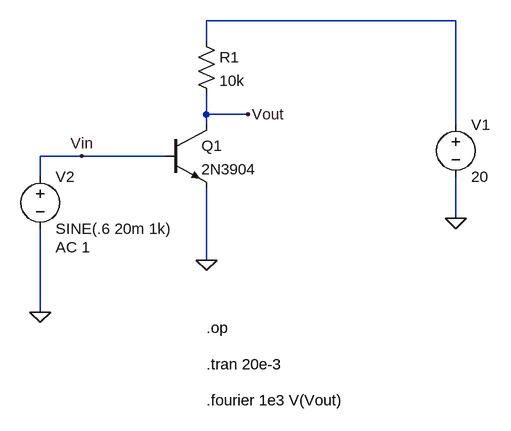
[diagram p0: schematic common_emitter_distortion.asc]
common_emitter_distortion.asc, the LTspice schematic file:
Version 4
SHEET 1 1576 680
WIRE 704 -48 320 -48
WIRE 320 -16 320 -48
WIRE 320 96 320 64
WIRE 384 96 320 96
WIRE 320 112 320 96
WIRE 704 112 704 -48
WIRE 128 160 64 160
WIRE 256 160 128 160
WIRE 64 192 64 160
WIRE 704 256 704 192
WIRE 320 320 320 208
WIRE 64 400 64 272
FLAG 704 256 0
FLAG 384 96 Vout
FLAG 128 160 Vin
FLAG 320 320 0
FLAG 64 400 0
SYMBOL voltage 704 96 R0
WINDOW 123 0 0 Left 0
WINDOW 39 0 0 Left 0
SYMATTR InstName V1
SYMATTR Value 20
SYMBOL voltage 64 176 R0
WINDOW 123 24 124 Left 2
WINDOW 39 24 124 Left 2
SYMATTR Value2 AC 1
SYMATTR InstName V2
SYMATTR Value SINE(.6 20m 1k)
SYMBOL res 304 -32 R0
SYMATTR InstName R1
SYMATTR Value 10k
SYMBOL npn3 256 112 R0
SYMATTR InstName Q1
SYMATTR Value 2N3904
TEXT 320 424 Left 2 !.op
TEXT 320 480 Left 2 !.tran 20e-3
TEXT 320 536 Left 2 !.fourier 1e3 V(Vout)

The netlist it stands for:
* common_emitter_distortion.asc
V1 N001 0 20
V2 Vin 0 SINE(.6 20m 1k) AC 1
R1 N001 Vout 10k
Q1 Vout Vin 0 0 2N3904
.model NPN NPN
.model PNP PNP
.lib standard.bjt
.op
.tran 20e-3
.fourier 1e3 V(Vout)
.backanno
.end